# EAGLE schematic class_3_board (EAGLE 9.3.0)
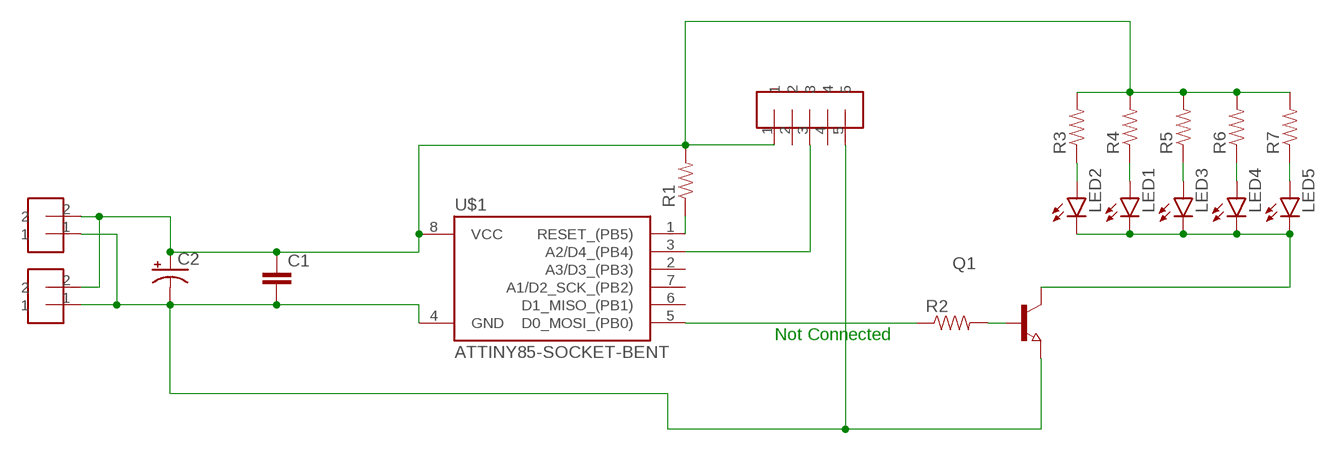
[diagram p0: schematic, sheet 1]

## Parts
C1  CAP0603-CAP  [0603-CAP]
C2  CAP_POLD  [PANASONIC_D]
LED1  LED0603  [LED-0603]
LED2  LED0603  [LED-0603]
LED3  LED0603  [LED-0603]
LED4  LED0603  [LED-0603]
LED5  LED0603  [LED-0603]
Q1  TRANSISTOR-NPN-SOT23  [SOT23]
R1  RESISTOR0603  [0603-RES]
R2  RESISTOR0603  [0603-RES]
R3  RESISTOR0603  [0603-RES]
R4  RESISTOR0603  [0603-RES]
R5  RESISTOR0603  [0603-RES]
R6  RESISTOR0603  [0603-RES]
R7  RESISTOR0603  [0603-RES]
U$1  ATTINY85-SOCKET-BENT  [SOCKET-8PIN-BENT]
U$2  HEADER-5  [HEADER-5]
U$3  HEADER-2  [HEADER-2]
U$4  HEADER-2  [HEADER-2]

## Nets
N$1: C1.1 C2.+ R1.2 R3.2 R4.2 R5.2 R6.2 R7.2 U$1.8(VCC) U$2.1 U$3.2 U$4.2
N$2: R1.1 U$1.1(RESET_(PB5))
N$3: C1.2 C2.- Q1.2(E) U$1.4(GND) U$2.5 U$3.1 U$4.1
N$4: R2.1 U$1.5(D0_MOSI_(PB0))
N$5: Q1.1(B) R2.2
N$6: U$1.3(A2/D4_(PB4)) U$2.3
N$7: LED2.A R3.1
N$8: LED4.A R6.1
N$9: LED5.A R7.1
N$10: LED3.A R5.1
N$11: LED1.A R4.1
N$12: LED1.C LED2.C LED3.C LED4.C LED5.C Q1.3(C)
Unconnected: U$1.2(A3/D3_(PB3)) U$1.6(D1_MISO_(PB1)) U$1.7(A1/D2_SCK_(PB2)) U$2.2 U$2.4

## Notes on the sheet
- Not Connected

## Library data of the parts
C1 = homemade-hardware:CAP: Capacitor Standard 0603 ceramic capacitor, and 0.1" leaded capacitor.
C2 = homemade-hardware:CAP_POL: Capacitor Polarized These are standard SMD and PTH capacitors. Normally 10uF, 47uF, and 100uF in electrolytic and tantalum varieties. Always verify the external diameter of the through hole cap, it varies with capacity, voltage, and manufacturer. The EIA devices should be standard.
LED1-LED5 = homemade-hardware:LED: LEDs Standard schematic elements and footprints for 5mm, 3mm, 1206, and 0603 sized LEDs. 5mm - Spark Fun Electronics SKU : COM-00529 (and others)
Q1 = homemade-hardware:TRANSISTOR-NPN: NPN Transistor BJT <https://www.digikey.com/product-detail/en/micro-commercial-co/MMBT2222A-TP/MMBT2222ATPMSCT-ND/717394>: MMBT2222A
R1-R7 = homemade-hardware:RESISTOR: Resistor Basic schematic elements and footprints for 0603, 1206, and PTH resistors.
U$1 = homemade-hardware:ATTINY85
U$2 = homemade-hardware:HEADER-5
U$3 U$4 = homemade-hardware:HEADER-2